# Altium schematic sheet PWR.SchDoc
size A2; SheetNumber: 4; SheetTotal: 6
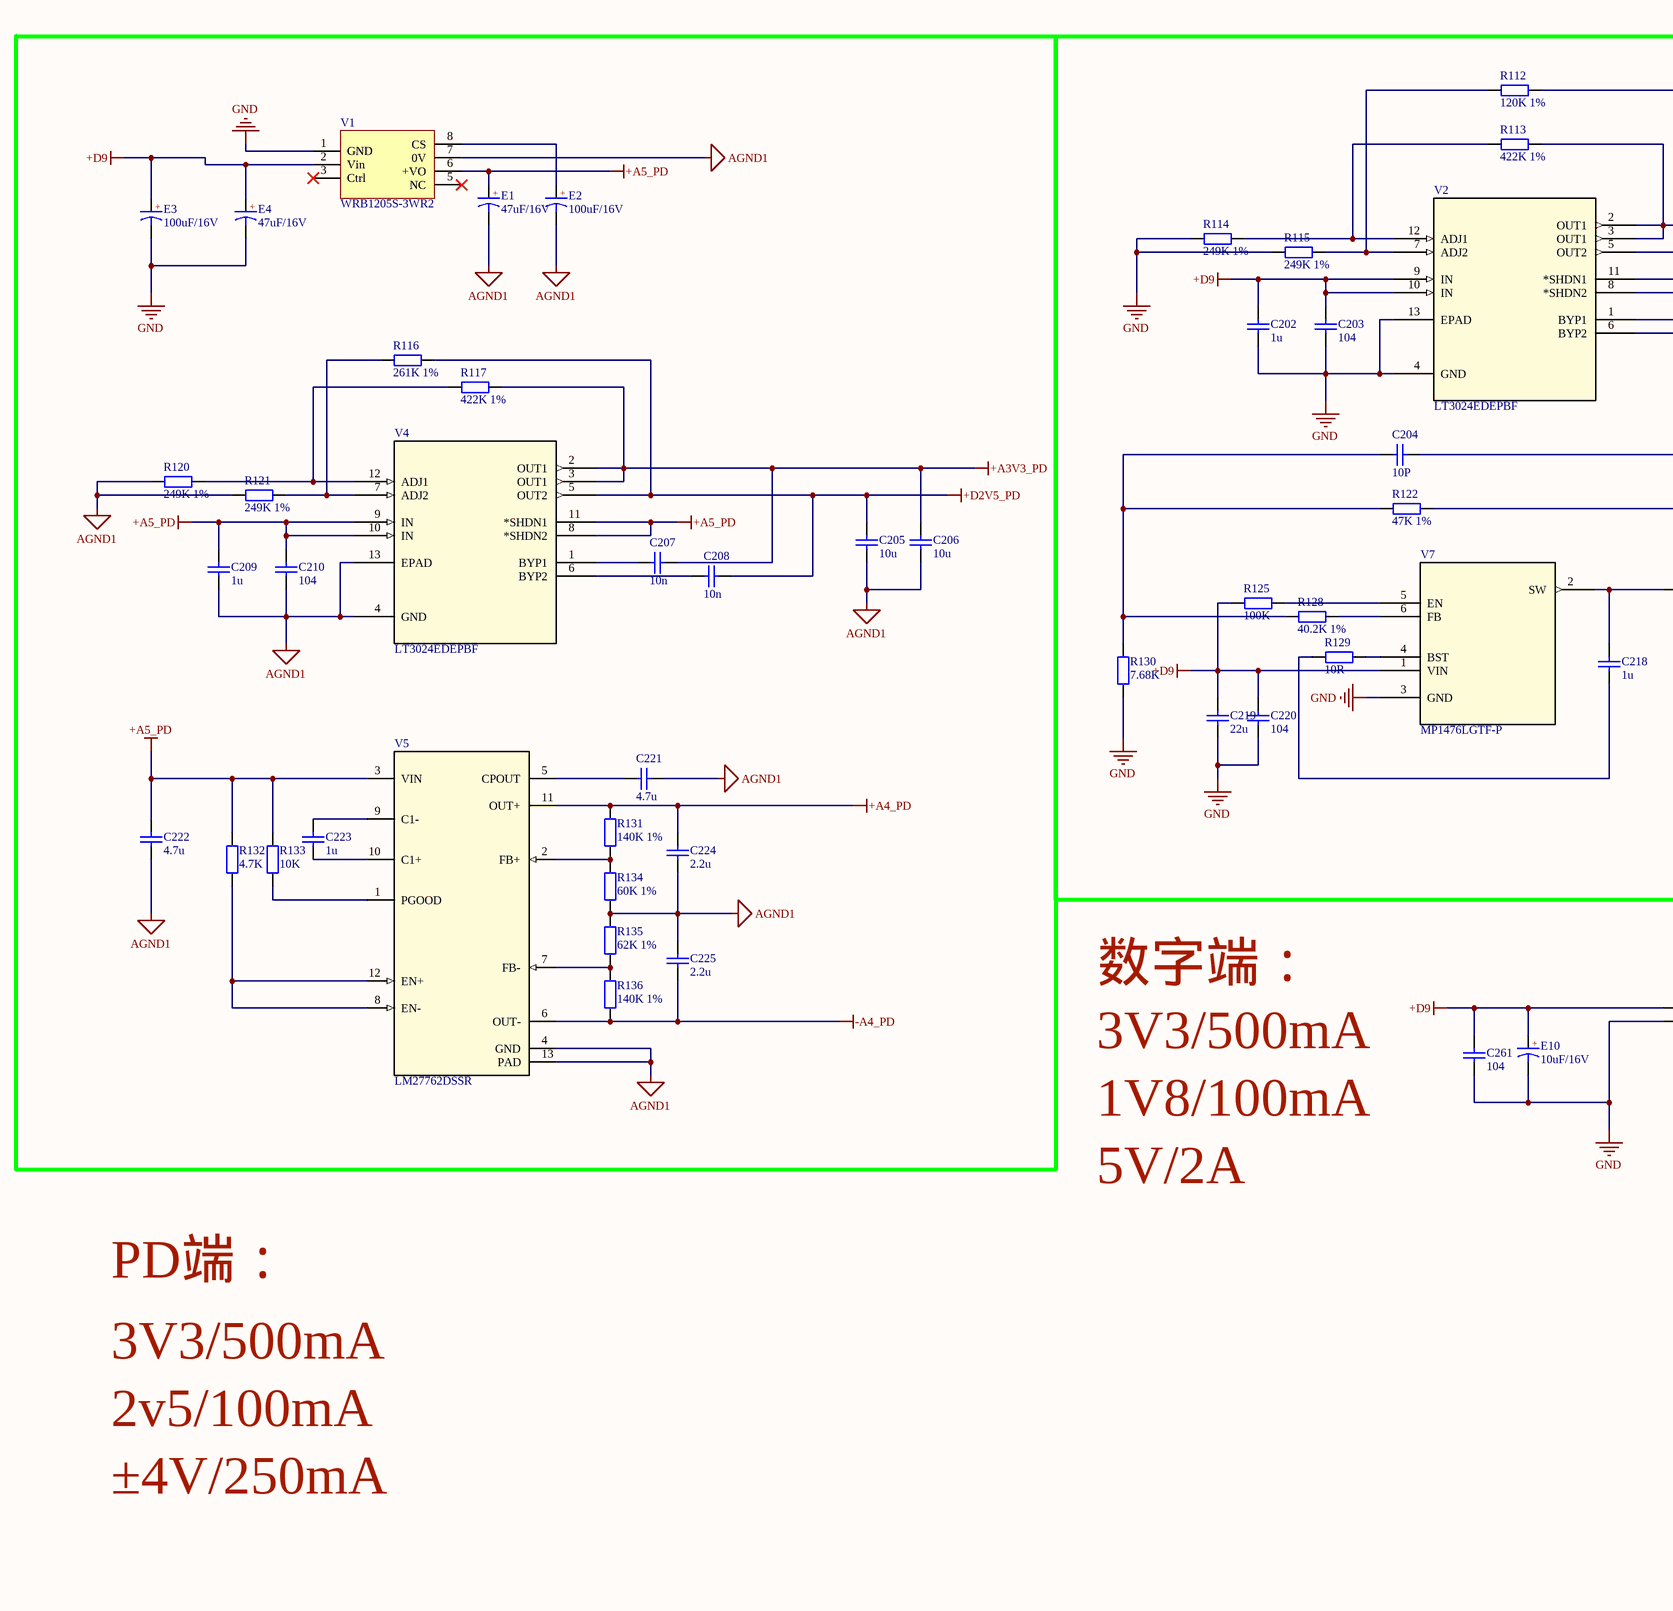
[diagram p0: PWR.SchDoc, left]
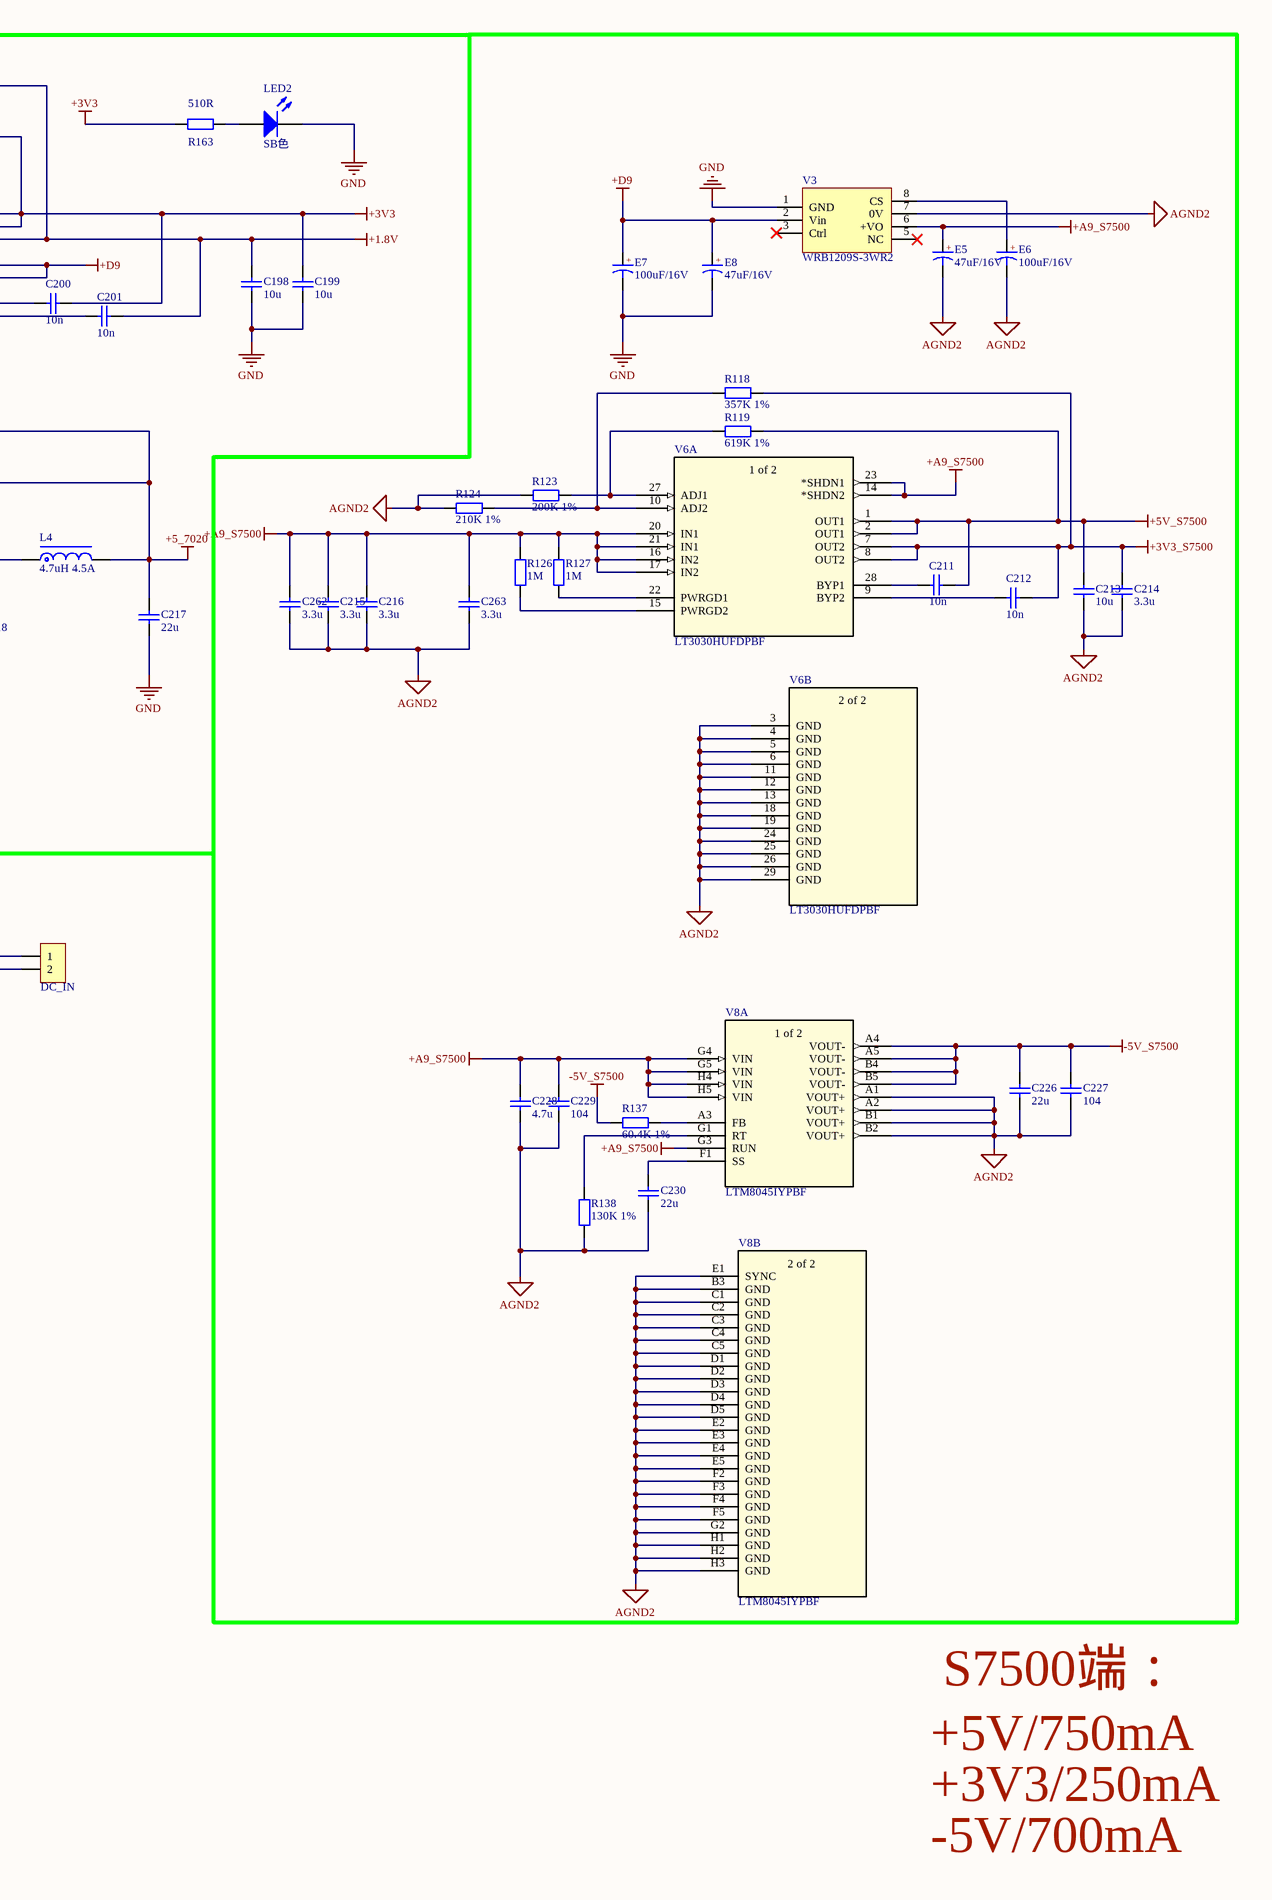
[diagram p1: PWR.SchDoc, right]

## Parts
C198  10u  [C0402_L]
C199  10u  [C0402_L]
C200  10n  [C0402_L]
C201  10n  [C0402_L]
C202  1u  [C0402_L]
C203  104  [C0402_L]
C204  10P  [C0402_L]
C205  10u  [C0402_L]
C206  10u  [C0402_L]
C207  10n  [C0402_L]
C208  10n  [C0402_L]
C209  1u  [C0402_L]
C210  104  [C0402_L]
C211  10n  [C0402_L]
C212  10n  [C0402_L]
C213  10u  [C0402_L]
C214  3.3u  [C0402_L]
C215  3.3u  [C0402_L]
C216  3.3u  [C0402_L]
C217  22u  [C0402_L]
C218  1u  [C0402_L]
C219  22u  [C0402_L]
C220  104  [C0402_L]
C221  4.7u  [C0402_L]
C222  4.7u  [C0402_L]
C223  1u  [C0402_L]
C224  2.2u  [C0402_L]
C225  2.2u  [C0402_L]
C226  22u  [C0402_L]
C227  104  [C0402_L]
C228  4.7u  [C0402_L]
C229  104  [C0402_L]
C230  22u  [C0402_L]
C261  104  [C0402_L]
C262  3.3u  [C0402_L]
C263  3.3u  [C0402_L]
DC_IN  HDR-1X2  [KF128-3.81-2P]  (value not drawn)
E1  47uF/16V  [C_6032]
E2  100uF/16V  [C_6032]
E3  100uF/16V  [C_6032]
E4  47uF/16V  [C_6032]
E5  47uF/16V  [C_6032]
E6  100uF/16V  [C_6032]
E7  100uF/16V  [C_6032]
E8  47uF/16V  [C_6032]
E10  10uF/16V  [C_3216]
L4  4.7uH 4.5A  [SWPA5020]
LED2  SB色  [LED0603_B]
R112  120K 1%  [R0402_L]
R113  422K 1%  [R0402_L]
R114  249K 1%  [R0402_L]
R115  249K 1%  [R0402_L]
R116  261K 1%  [R0402_L]
R117  422K 1%  [R0402_L]
R118  357K 1%  [R0402_L]
R119  619K 1%  [R0402_L]
R120  249K 1%  [R0402_L]
R121  249K 1%  [R0402_L]
R122  47K 1%  [R0402_L]
R123  200K 1%  [R0402_L]
R124  210K 1%  [R0402_L]
R125  100K  [R0402_L]
R126  1M  [R0402_L]
R127  1M  [R0402_L]
R128  40.2K 1%  [R0402_L]
R129  10R  [R0402_L]
R130  7.68K  [R0402_L]
R131  140K 1%  [R0402_L]
R132  4.7K  [R0402_L]
R133  10K  [R0402_L]
R134  60K 1%  [R0402_L]
R135  62K 1%  [R0402_L]
R136  140K 1%  [R0402_L]
R137  60.4K 1%  [R0402_L]
R138  130K 1%  [R0402_L]
R163  510R  [R0603_L]
V1  WRB1205S-3WR2  [WRB_S-3WR2]
V2  LT3024EDEPBF  [DFN-12_DE_LIT]
V3  WRB1209S-3WR2  [WRB_S-3WR2]
V4  LT3024EDEPBF  [DFN-12_DE_LIT]
V5  LM27762DSSR  [DSS0012B]
V6  LT3030HUFDPBF  [QFN-28_UFD_LIT]  (parts A,B of 2)
V7  MP1476LGTF-P  [SOT563_MP1476L_MNP]
V8  LTM8045IYPBF  [BGA-40_11P25X6P25_LIT]  (parts A,B of 2)

## Nets
+1.8V: C198.1 C201.2 R112.2 V2.5(OUT2)
+3V3: C199.1 C200.2 R113.2 R163.1 V2.2(OUT1) V2.3(OUT1)
+3V3_S7500: C212.2 C214.2 R118.2 V6.7(OUT2) V6.8(OUT2)
+5_7020: C204.2 C217.2 L4.2 R122.2
+5V_S7500: C211.2 C213.2 R119.2 V6.1(OUT1) V6.2(OUT1)
+A3V3_PD: C206.1 C207.2 R117.2 V4.2(OUT1) V4.3(OUT1)
+A4_PD: C224.2 R131.2 V5.11(OUT+)
+A5_PD: C209.1 C210.1 C222.1 E1.1(A) R132.2 R133.2 V1.6(+VO) V4.8(*SHDN2) V4.9(IN) V4.10(IN) V4.11(*SHDN1) V5.3(VIN)
+A9_S7500: C215.2 C216.2 C228.1 C229.1 C262.2 C263.2 E5.1(A) R126.2 R127.2 V3.6(+VO) V6.14(*SHDN2) V6.16(IN2) V6.17(IN2) V6.20(IN1) V6.21(IN1) V6.23(*SHDN1) V8.G3(RUN) V8.G4(VIN) V8.G5(VIN) V8.H4(VIN) V8.H5(VIN)
+D2V5_PD: C205.1 C208.2 R116.2 V4.5(OUT2)
+D9: C202.1 C203.1 C219.2 C220.2 C261.2 DC_IN.1 E3.1(A) E4.1(A) E7.1(A) E8.1(A) E10.1(A) R125.1 V1.2(Vin) V2.8(*SHDN2) V2.9(IN) V2.10(IN) V2.11(*SHDN1) V3.2(Vin) V7.1(VIN)
-5V_S7500: C226.1 C227.1 R137.1 V8.A4(VOUT-) V8.A5(VOUT-) V8.B4(VOUT-) V8.B5(VOUT-)
-A4_PD: C225.1 R136.1 V5.6(OUT-)
AGND1: C205.2 C206.2 C209.2 C210.2 C221.2 C222.2 C224.1 C225.2 E1.2(K) E2.2(K) R120.1 R121.1 R134.1 R135.2 V1.7(0V) V4.4(GND) V4.13(EPAD) V5.4(GND) V5.13(PAD)
AGND2: C213.1 C214.1 C215.1 C216.1 C226.2 C227.2 C228.2 C229.2 C230.2 C262.1 C263.1 E5.2(K) E6.2(K) R123.1 R124.1 R138.1 V3.7(0V) V6.3(GND) V6.4(GND) V6.5(GND) V6.6(GND) V6.11(GND) V6.12(GND) V6.13(GND) V6.18(GND) V6.19(GND) V6.24(GND) V6.25(GND) V6.26(GND) V6.29(GND) V8.A1(VOUT+) V8.A2(VOUT+) V8.B1(VOUT+) V8.B2(VOUT+) V8.B3(GND) V8.C1(GND) V8.C2(GND) V8.C3(GND) V8.C4(GND) V8.C5(GND) V8.D1(GND) V8.D2(GND) V8.D3(GND) V8.D4(GND) V8.D5(GND) V8.E1(SYNC) V8.E2(GND) V8.E3(GND) V8.E4(GND) V8.E5(GND) V8.F2(GND) V8.F3(GND) V8.F4(GND) V8.F5(GND) V8.G2(GND) V8.H1(GND) V8.H2(GND) V8.H3(GND)
GND: C198.2 C199.2 C202.2 C203.2 C217.1 C219.1 C220.1 C261.1 DC_IN.2 E3.2(K) E4.2(K) E7.2(K) E8.2(K) E10.2(K) LED2.2(K) R114.1 R115.1 R130.1 V1.1(GND) V2.4(GND) V2.13(EPAD) V3.1(GND) V7.3(GND)
NetC200_1: C200.1 V2.1(BYP1)
NetC201_1: C201.1 V2.6(BYP2)
NetC204_1: C204.1 R122.1 R128.1 R130.2
NetC207_1: C207.1 V4.1(BYP1)
NetC208_1: C208.1 V4.6(BYP2)
NetC211_1: C211.1 V6.28(BYP1)
NetC212_1: C212.1 V6.9(BYP2)
NetC218_1: C218.1 R129.1
NetC218_2: C218.2 L4.1 V7.2(SW)
NetC221_1: C221.1 V5.5(CPOUT)
NetC223_1: C223.1 V5.9(C1-)
NetC223_2: C223.2 V5.10(C1+)
NetC230_1: C230.1 V8.F1(SS)
NetE2_1: E2.1(A) V1.8(CS)
NetE6_1: E6.1(A) V3.8(CS)
NetLED2_1: LED2.1(A) R163.2
NetR112_1: R112.1 R115.2 V2.7(ADJ2)
NetR113_1: R113.1 R114.2 V2.12(ADJ1)
NetR116_1: R116.1 R121.2 V4.7(ADJ2)
NetR117_1: R117.1 R120.2 V4.12(ADJ1)
NetR118_1: R118.1 R124.2 V6.10(ADJ2)
NetR119_1: R119.1 R123.2 V6.27(ADJ1)
NetR125_2: R125.2 V7.5(EN)
NetR126_1: R126.1 V6.15(PWRGD2)
NetR127_1: R127.1 V6.22(PWRGD1)
NetR128_2: R128.2 V7.6(FB)
NetR129_2: R129.2 V7.4(BST)
NetR131_1: R131.1 R134.2 V5.2(FB+)
NetR132_1: R132.1 V5.8(EN-) V5.12(EN+)
NetR133_1: R133.1 V5.1(PGOOD)
NetR135_1: R135.1 R136.2 V5.7(FB-)
NetR137_2: R137.2 V8.A3(FB)
NetR138_2: R138.2 V8.G1(RT)

Not connected (* = marked no-connect by the designer): V1 3(Ctrl)* 5(NC)*; V3 3(Ctrl)* 5(NC)*

## Notes on the sheet
- 数字端：
- 3V3/500mA
- 1V8/100mA
- 5V/2A
- PD端：
- 2v5/100mA
- ±4V/250mA
- S7500端：
- +5V/750mA
- +3V3/250mA
- -5V/700mA
- (in symbol CT) +
- (in symbol LT3030HUFDPBF, part A) 1 of 2
- (in symbol LT3030HUFDPBF, part B) 2 of 2
- (in symbol LTM8045IYPBF, part A) 1 of 2
- (in symbol LTM8045IYPBF, part B) 2 of 2

## Library data of the parts
C198-C230 C261-C263 = C: 贴片电容/MLCC电容; BOM名称: 无极性贴片电容; 当前库版本V2023.5.31 @淘宝卖家:黄晶宝石: 最新版本发布https://item.taobao.com/item.htm?id=566775463719
DC_IN = Header 2: 2P接插件; 当前库版本V2022.10.7 @淘宝卖家:黄晶宝石: 最新版本发布https://shop463601444.taobao.com; BOM名称: 2P接插件
E1-E8 E10 = CT: 贴片钽电容; 当前库版本V2023.5.31 @淘宝卖家:黄晶宝石: 最新版本发布https://item.taobao.com/item.htm?id=566775463719; BOM名称: 贴片钽电容
L4 = L-SWPA: 顺络_SWPA贴片屏蔽电感; BOM名称: 功率屏蔽电感; 当前库版本V2023.5.31 @淘宝卖家:黄晶宝石: 最新版本发布https://item.taobao.com/item.htm?id=566775463719
LED2 = LED: 贴片LED; 封装库来自淘宝卖家：黄晶宝石: 其他店铺购入均为盗版封装库，无更新权益，请立即申请退款，本店现金奖励200~1000元; BOM名称: 贴片LED
R112-R138 R163 = R: 贴片电阻; 联系下单店铺卖家 免费帮你查找封装: 联系下单店铺卖家 免费技术支持; BOM名称: 贴片电阻
V1 V3 = WRB_S-3WR2
V2 V4 = LT3024EDEPBF: No Description Available; Mfr_Name: Analog Devices Inc; RefDes: RefDes; Type: Type
V5 = LM27762DSSR: No Description Available; Mfr_Name: Texas Instruments; Type: DEV; RefDes: RefDes; Copyright: Copyright (C) 2023 Ultra Librarian. All rights reserved.; Manufacturer_Part_Number: LM27762DSSR
V6 = LT3030HUFDPBF: No Description Available; Mfr_Name: Analog Devices Inc; RefDes: RefDes; Type: Type
V7 = MP1476LGTF-P: No Description Available; Mfr_Name: Monolithic Power Systems; RefDes: RefDes; Type: Type
V8 = LTM8045IYPBF: No Description Available; Mfr_Name: Analog Devices Inc; RefDes: RefDes; Type: Type